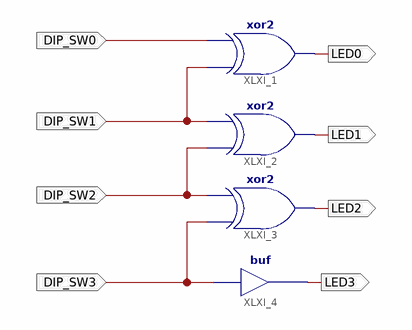
[diagram p0: schematic sheet 1]
// Xilinx ISE schematic lab4_xor2.sch (spartan3) as structural Verilog: 4 symbols, 8 ports
module lab4_xor2 (
  input  DIP_SW0,
  input  DIP_SW1,
  input  DIP_SW2,
  input  DIP_SW3,
  output LED0,
  output LED1,
  output LED2,
  output LED3
);

  xor XLXI_1 (LED0, DIP_SW1, DIP_SW0);
  xor XLXI_2 (LED1, DIP_SW2, DIP_SW1);
  xor XLXI_3 (LED2, DIP_SW3, DIP_SW2);
  buf XLXI_4 (LED3, DIP_SW3);
endmodule
